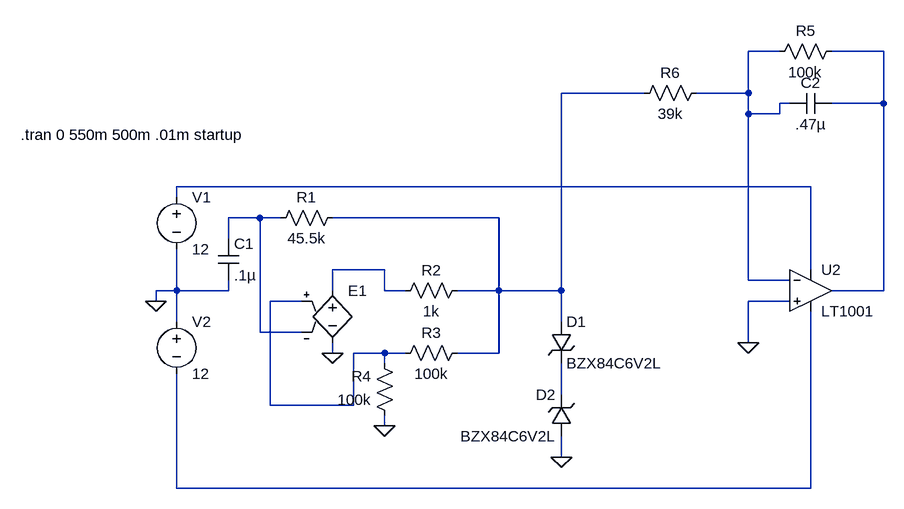
[diagram p0: schematic lab_amp_op_2.asc]
lab_amp_op_2.asc, the LTspice schematic file:
Version 4
SHEET 1 996 680
WIRE 816 -176 768 -176
WIRE 976 -176 896 -176
WIRE 608 -112 480 -112
WIRE 768 -112 768 -176
WIRE 768 -112 688 -112
WIRE 832 -96 816 -96
WIRE 976 -96 976 -176
WIRE 976 -96 896 -96
WIRE 768 -80 768 -112
WIRE 816 -80 816 -96
WIRE 816 -80 768 -80
WIRE 864 32 -112 32
WIRE -112 48 -112 32
WIRE 16 80 -32 80
WIRE 48 80 16 80
WIRE 384 80 128 80
WIRE -32 112 -32 80
WIRE 208 160 128 160
WIRE 864 160 864 32
WIRE 768 176 768 -80
WIRE 832 176 768 176
WIRE -112 192 -112 128
WIRE -112 192 -144 192
WIRE -32 192 -32 176
WIRE -32 192 -112 192
WIRE 128 192 128 160
WIRE 208 192 208 160
WIRE 240 192 208 192
WIRE 384 192 384 80
WIRE 384 192 320 192
WIRE 480 192 480 -112
WIRE 480 192 384 192
WIRE 976 192 976 -96
WIRE 976 192 896 192
WIRE -144 208 -144 192
WIRE 80 208 32 208
WIRE 832 208 768 208
WIRE -112 240 -112 192
WIRE 480 240 480 192
WIRE 16 256 16 80
WIRE 80 256 16 256
WIRE 768 272 768 208
WIRE 128 288 128 272
WIRE 208 288 160 288
WIRE 240 288 208 288
WIRE 384 288 384 192
WIRE 384 288 320 288
WIRE 208 304 208 288
WIRE 480 352 480 304
WIRE 32 368 32 208
WIRE 160 368 160 288
WIRE 160 368 32 368
WIRE 208 400 208 384
WIRE 480 448 480 416
WIRE -112 496 -112 320
WIRE 864 496 864 224
WIRE 864 496 -112 496
FLAG -144 208 0
FLAG 208 400 0
FLAG 480 448 0
FLAG 768 272 0
FLAG 128 288 0
SYMBOL voltage -112 32 R0
WINDOW 123 0 0 Left 2
WINDOW 39 0 0 Left 2
SYMATTR InstName V1
SYMATTR Value 12
SYMBOL voltage -112 224 R0
WINDOW 123 0 0 Left 2
WINDOW 39 0 0 Left 2
SYMATTR InstName V2
SYMATTR Value 12
SYMBOL res 144 64 R90
WINDOW 0 0 56 VBottom 2
WINDOW 3 32 56 VTop 2
SYMATTR InstName R1
SYMATTR Value 45.5k
SYMBOL res 336 176 R90
WINDOW 0 0 56 VBottom 2
WINDOW 3 32 56 VTop 2
SYMATTR InstName R2
SYMATTR Value 1k
SYMBOL res 336 272 R90
WINDOW 0 0 56 VBottom 2
WINDOW 3 32 56 VTop 2
SYMATTR InstName R3
SYMATTR Value 100k
SYMBOL res 224 400 R180
WINDOW 0 36 76 Left 2
WINDOW 3 36 40 Left 2
SYMATTR InstName R4
SYMATTR Value 100k
SYMBOL cap -48 112 R0
SYMATTR InstName C1
SYMATTR Value .1µ
SYMBOL zener 464 240 R0
SYMATTR InstName D1
SYMATTR Value BZX84C6V2L
SYMBOL zener 496 416 R180
WINDOW 0 24 64 Left 2
WINDOW 3 24 0 Left 2
SYMATTR InstName D2
SYMATTR Value BZX84C6V2L
SYMBOL Opamps\\LT1001 864 128 R0
SYMATTR InstName U2
SYMBOL cap 896 -112 R90
WINDOW 0 0 32 VBottom 2
WINDOW 3 32 32 VTop 2
SYMATTR InstName C2
SYMATTR Value .47µ
SYMBOL res 912 -192 R90
WINDOW 0 0 56 VBottom 2
WINDOW 3 32 56 VTop 2
SYMATTR InstName R5
SYMATTR Value 100k
SYMBOL res 704 -128 R90
WINDOW 0 0 56 VBottom 2
WINDOW 3 32 56 VTop 2
SYMATTR InstName R6
SYMATTR Value 39k
SYMBOL e 128 176 R0
WINDOW 3 24 96 Invisible 2
SYMATTR Value (-100,-12)(-.6u,-12)(.6u,12)(100,12)
SYMATTR InstName E1
SYMATTR SpiceModel table
TEXT -352 -48 Left 2 !.tran 0 550m 500m .01m startup

The netlist it stands for:
* lab_amp_op_2.asc
V1 N004 0 12
V2 0 N009 12
R1 N003 N005 45.5k
R2 N003 N006 1k
R3 N003 N007 100k
R4 0 N007 100k
C1 N005 0 .1µ
D1 N003 N008 BZX84C6V2L
D2 0 N008 BZX84C6V2L
XU2 0 N001 N004 N009 N002 LT1001  ; pins In+ In- V+ V- OUT
C2 N002 N001 .47µ
R5 N002 N001 100k
R6 N001 N003 39k
E1 N006 0 N007 N005 table (-100,-12)(-.6u,-12)(.6u,12)(100,12)
.model D D
.lib standard.dio
.tran 0 550m 500m .01m startup
.lib LTC.lib
.backanno
.end